# Altium project Social_Security_Master V2.4.PrjPcb
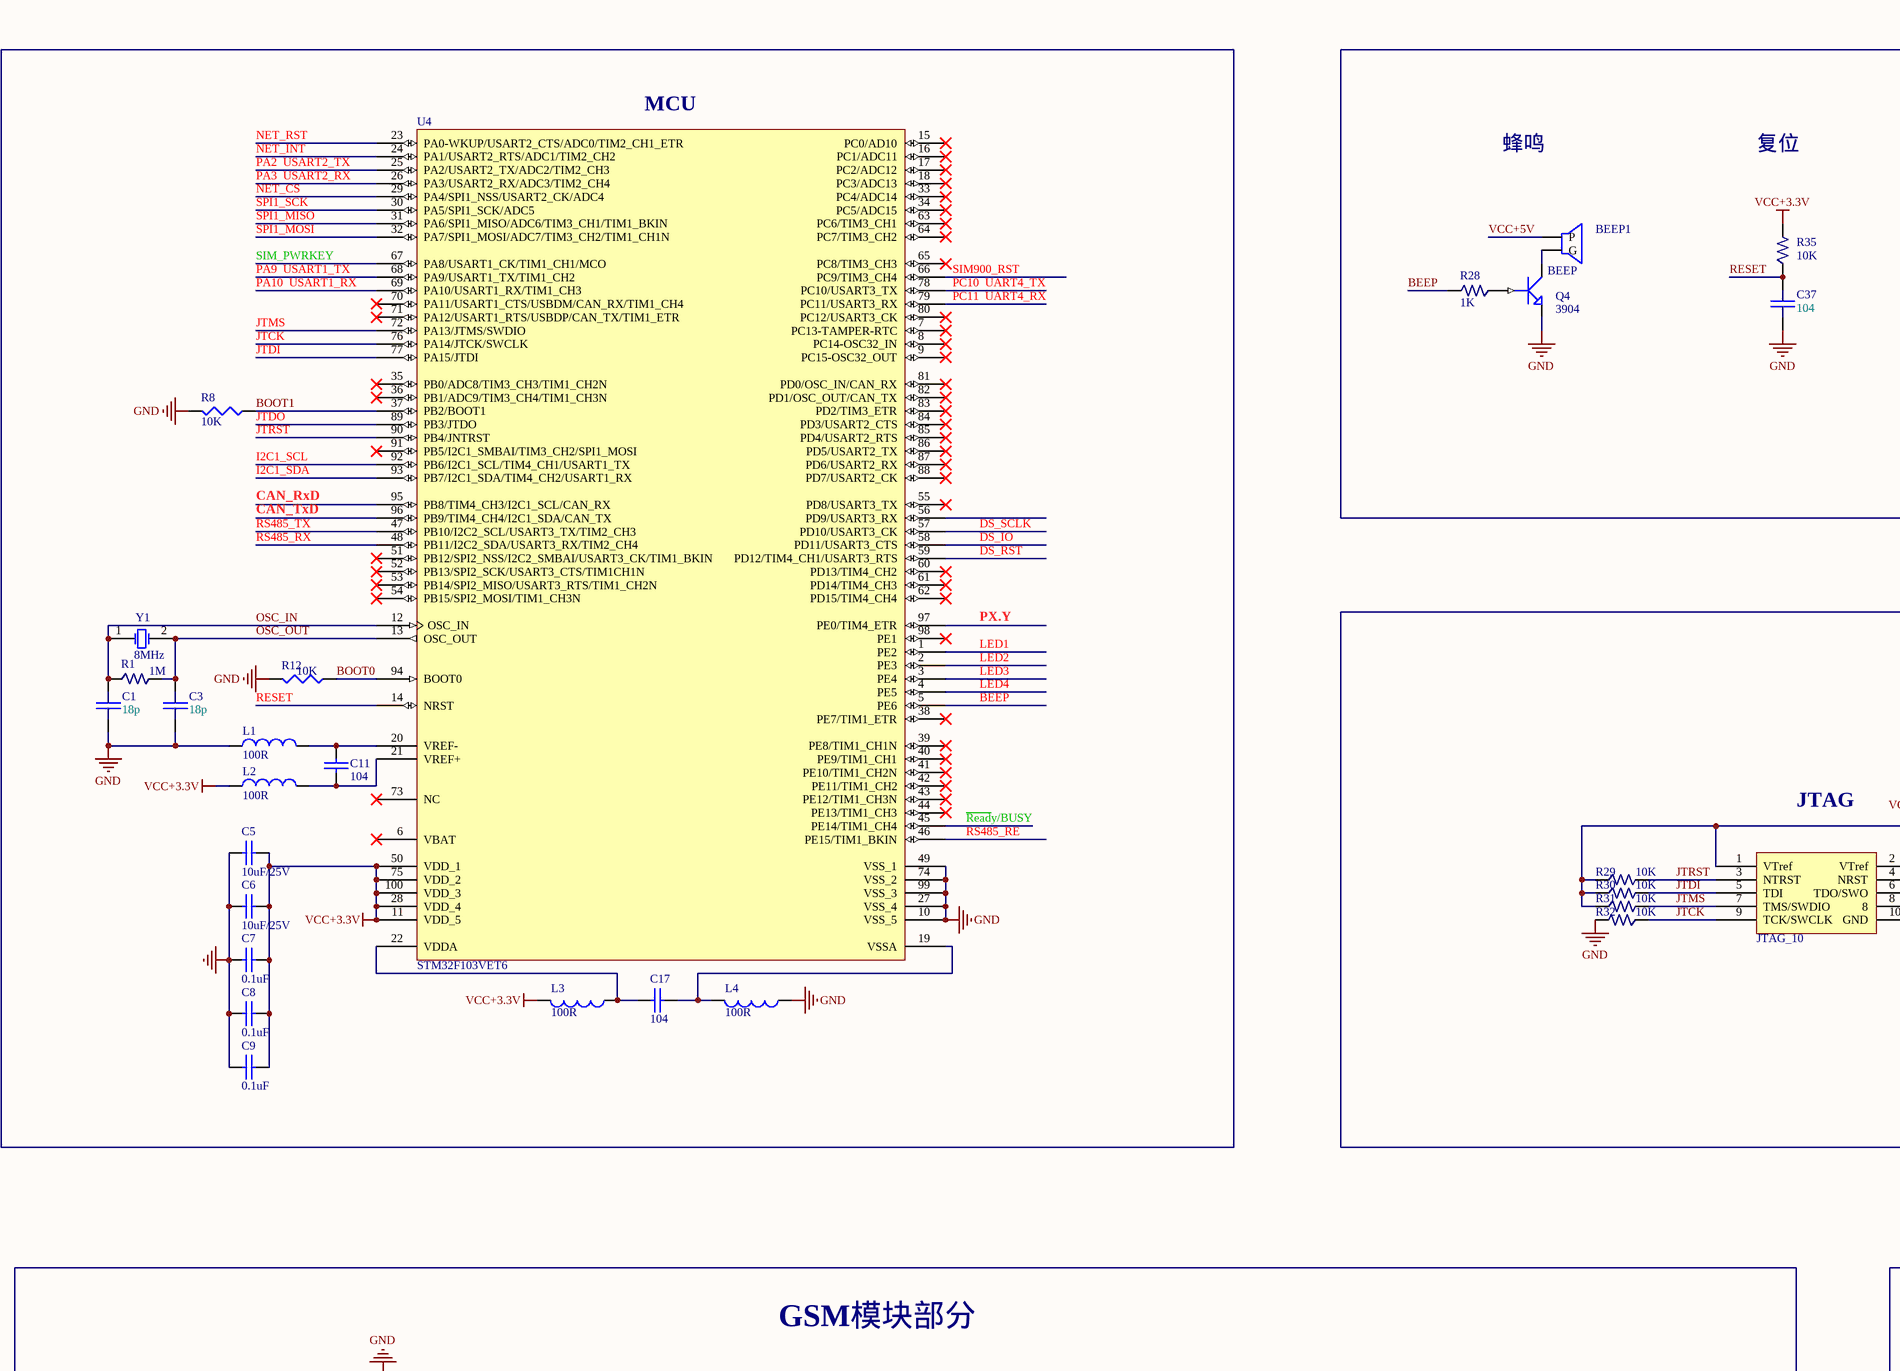
[diagram p0: Sheet1.SchDoc, top left]
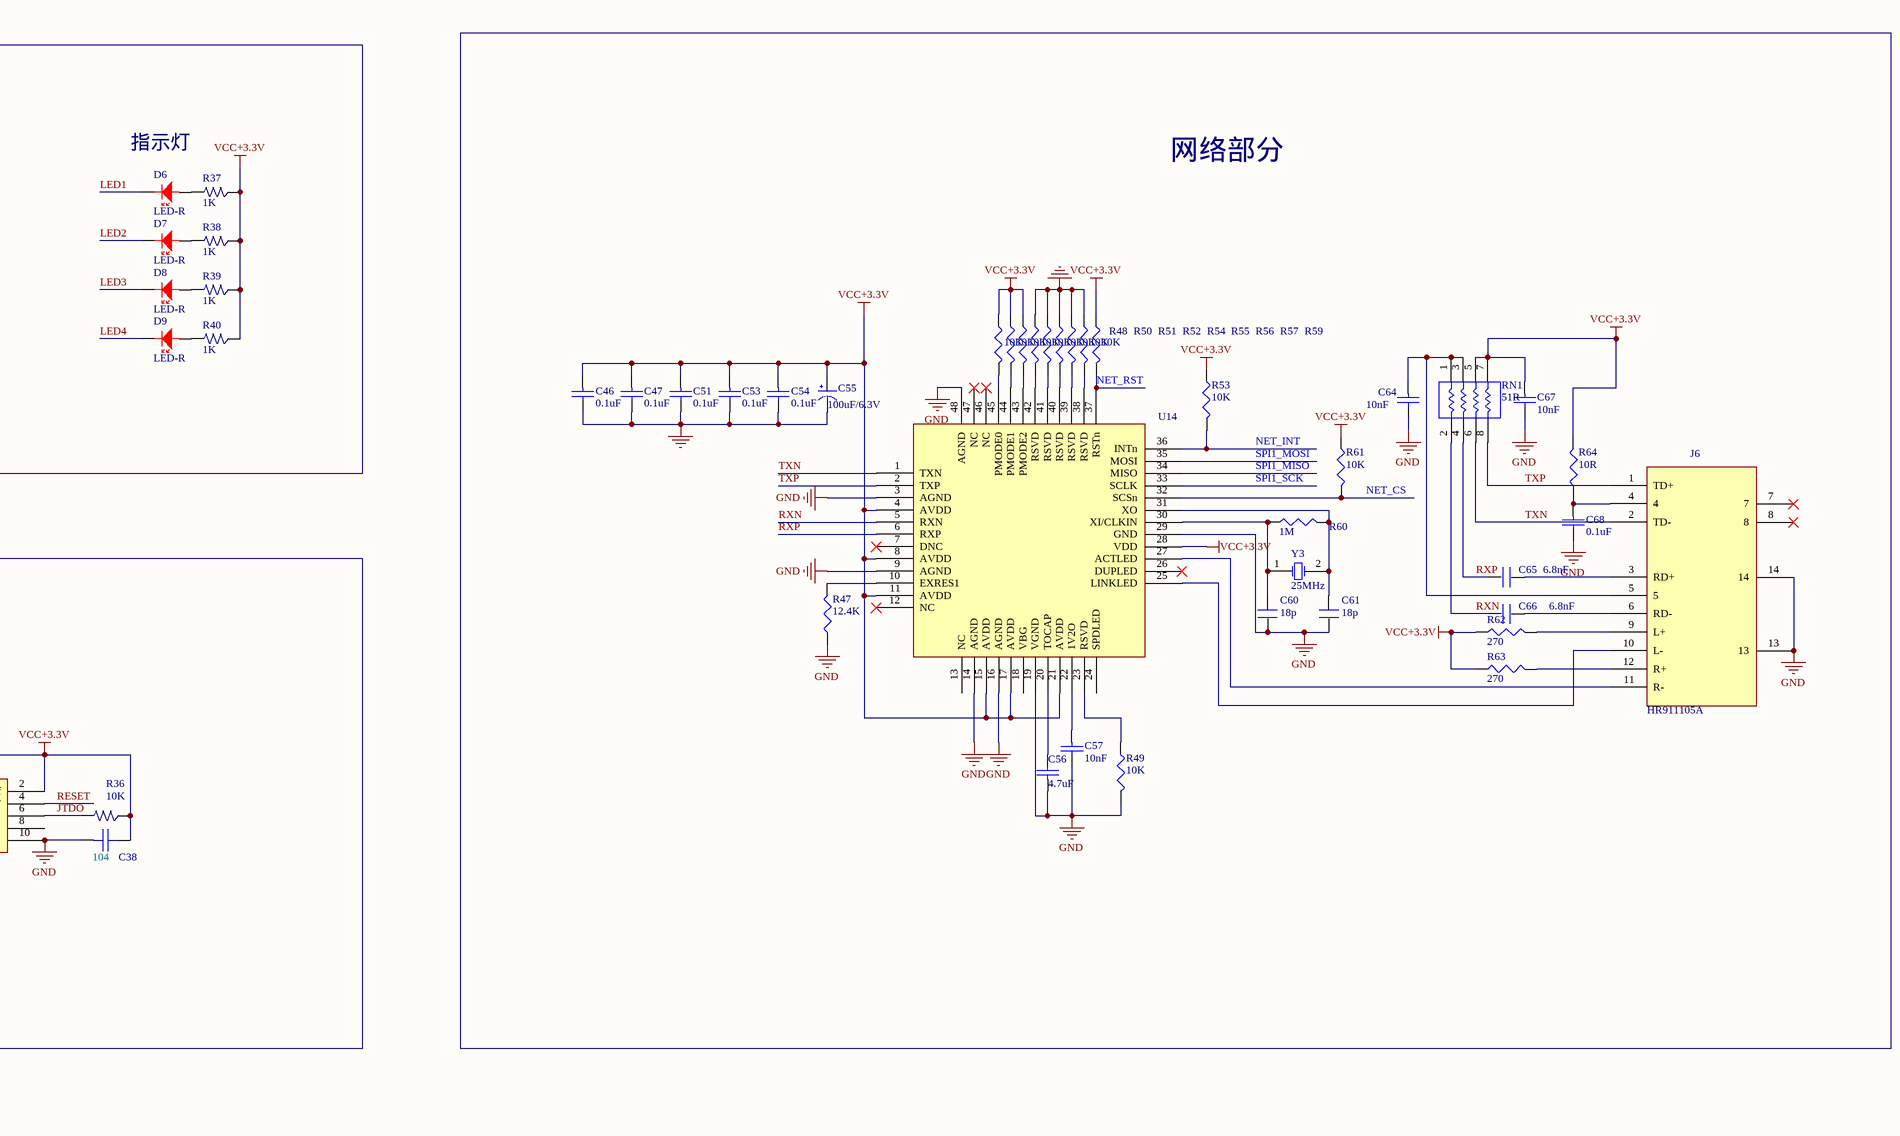
[diagram p1: Sheet1.SchDoc, top right]
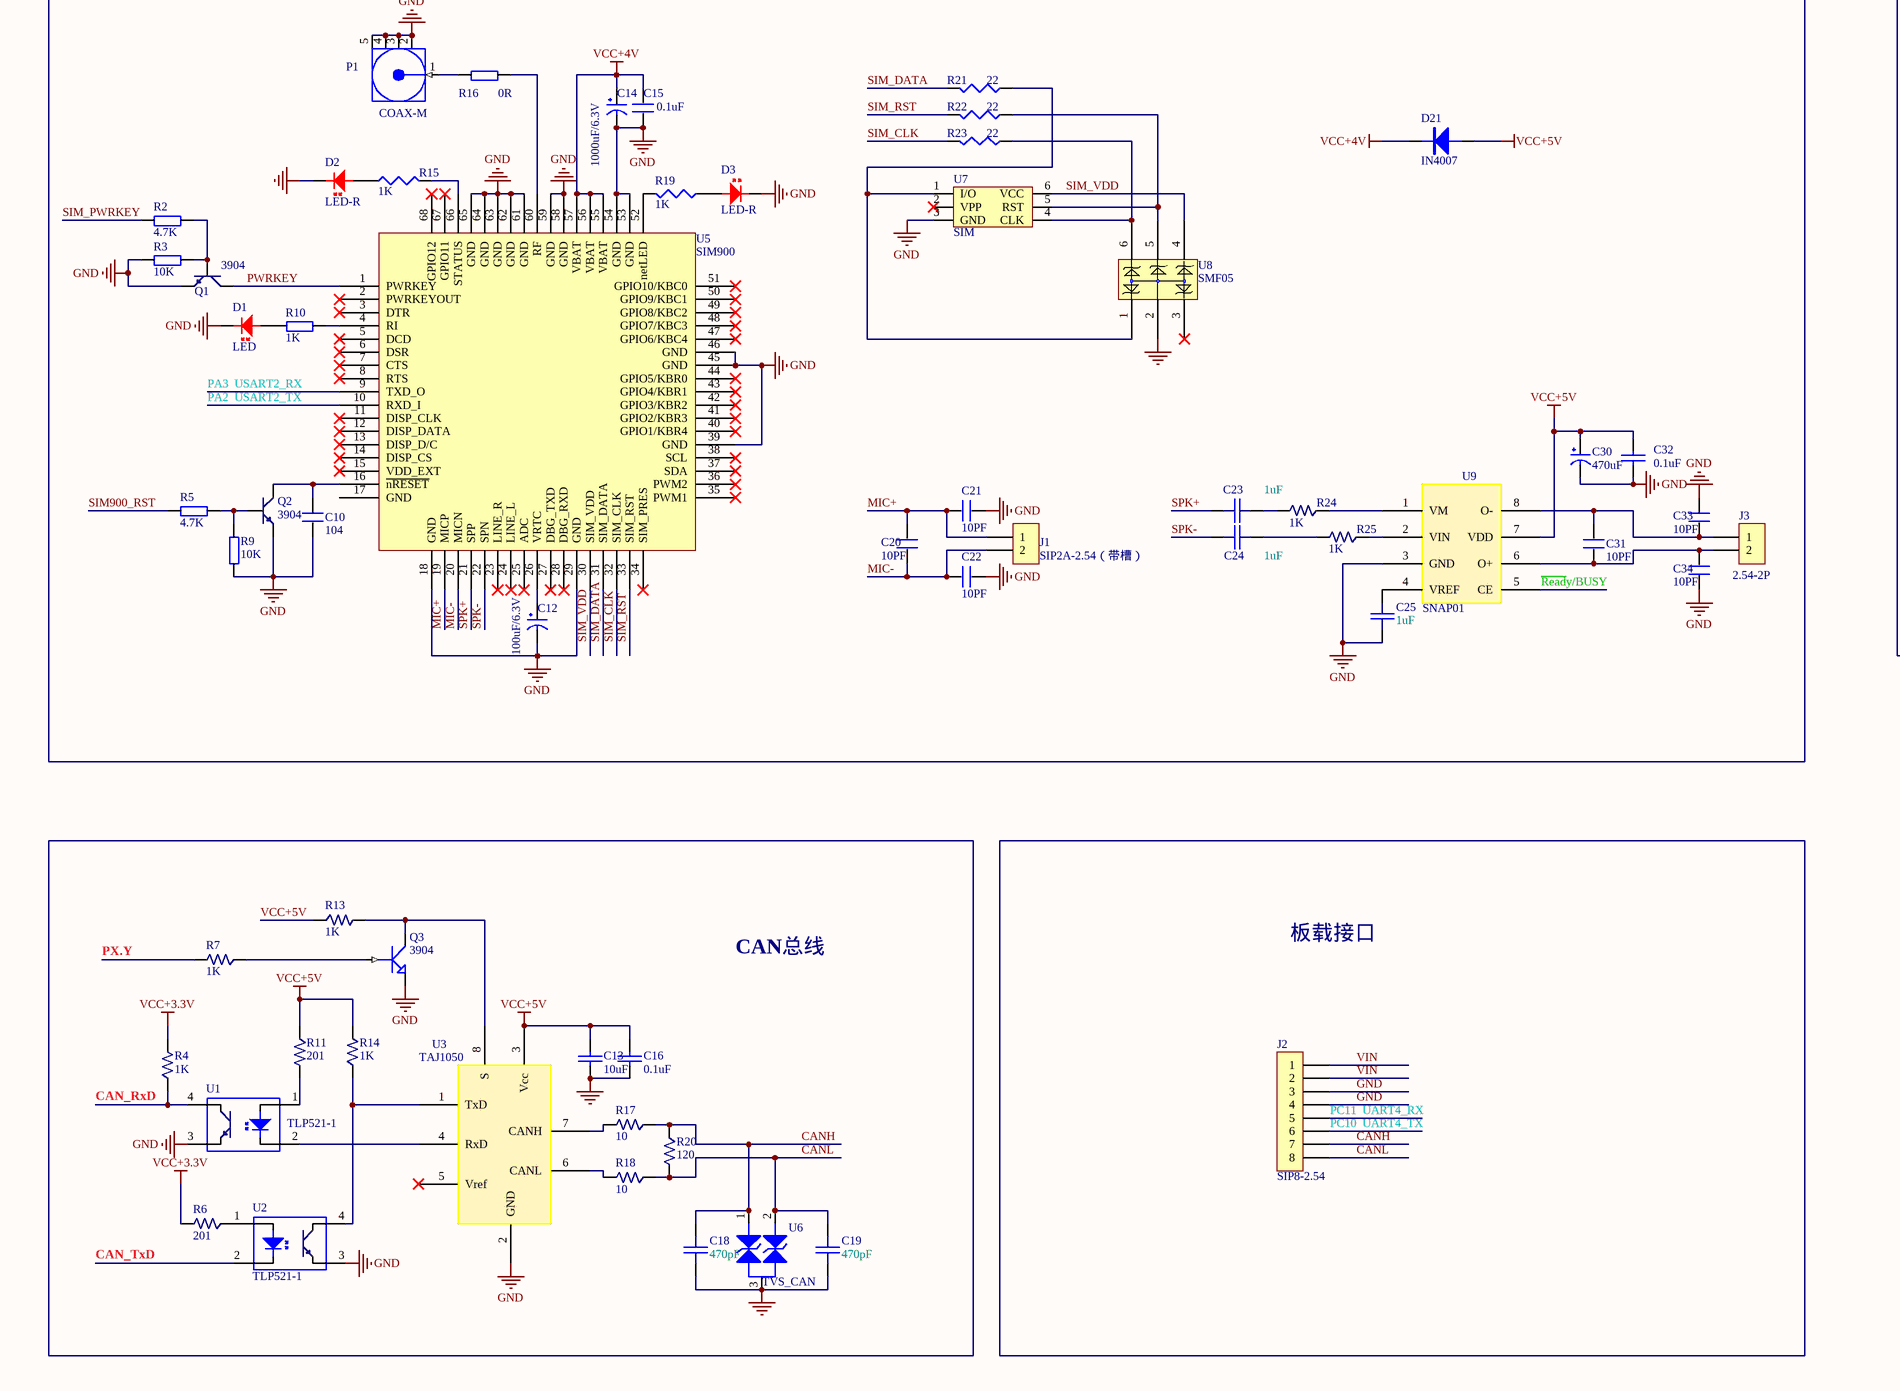
[diagram p2: Sheet1.SchDoc, bottom left]
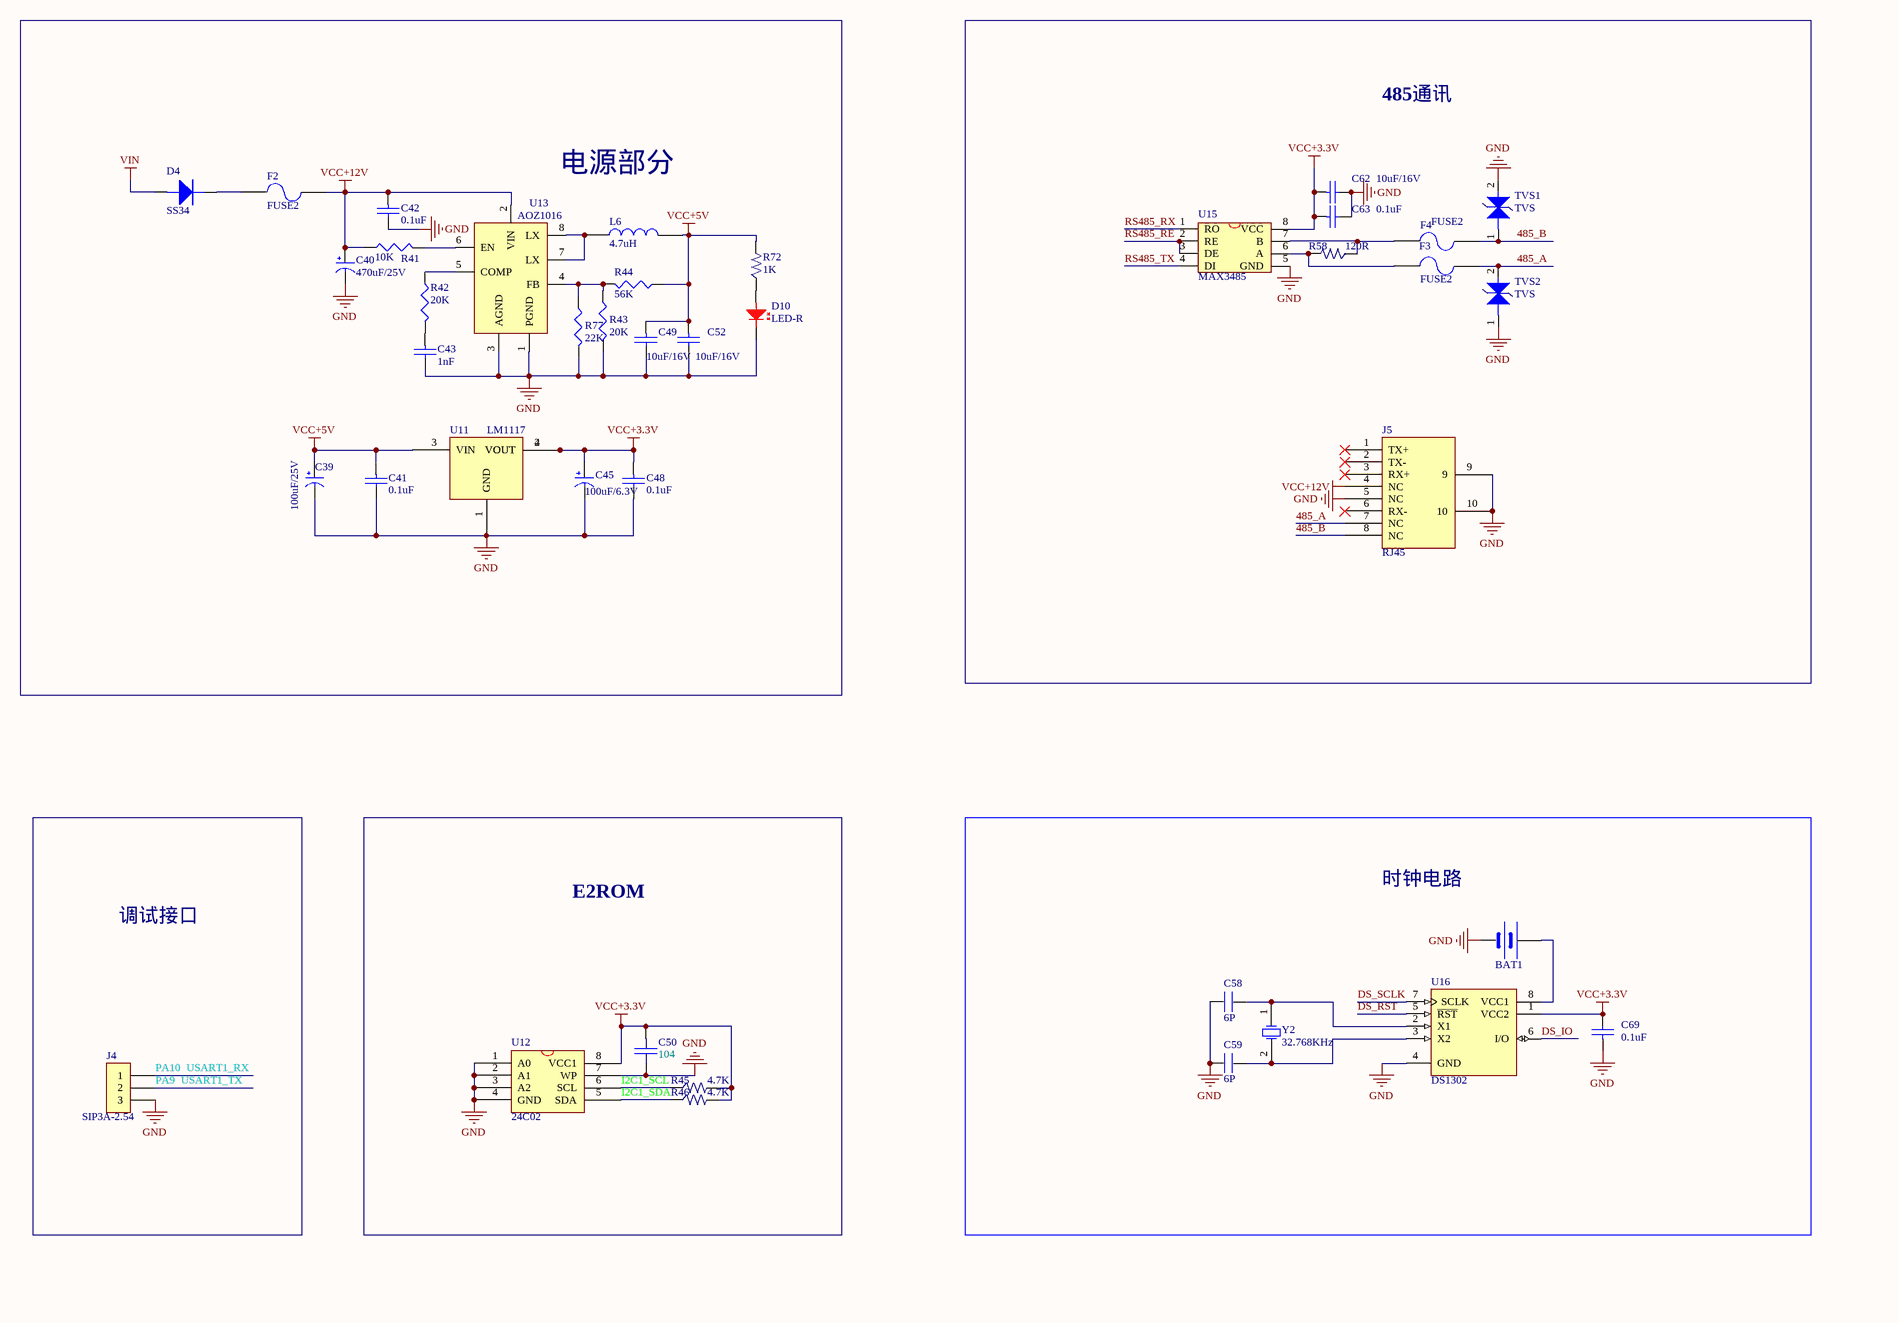
[diagram p3: Sheet1.SchDoc, bottom right]
1 sheet, 175 parts. Net scope: global (net labels, ports and power ports of the same name join across sheets).
Board file: PCB1.PcbDoc

## Sheet Sheet1.SchDoc
size A1

### Parts
BAT1  BATT  [CR1220]  (value not drawn)
BEEP1  BEEP  [BEEP-12]
C1  18p  [0603]
C3  18p  [0603]
C5  10uF/25V  [0805]
C6  10uF/25V  [0805]
C7  0.1uF  [0603]
C8  0.1uF  [0603]
C9  0.1uF  [0603]
C10  104  [0603]
C11  104  [0603]
C12  100uF/6.3V  [A-3528]
C13  10uF  [0805]
C14  1000uF/6.3V  [7343]
C15  0.1uF  [0805]
C16  0.1uF  [0603]
C17  104  [0603]
C18  470pF  [0603]
C19  470pF  [0603]
C20  10PF  [0603]
C21  10PF  [0603]
C22  10PF  [0603]
C23  1uF  [0603]
C24  1uF  [0603]
C25  1uF  [0603]
C30  470uF  [RB3.5]
C31  10PF  [0603]
C32  0.1uF  [0603]
C33  10PF  [0603]
C34  10PF  [0603]
C37  104  [0603]
C38  104  [0603]
C39  100uF/25V  [RB2.54]
C40  470uF/25V  [RB3.5]
C41  0.1uF  [0603]
C42  0.1uF  [0603]
C43  1nF  [0603]
C45  100uF/6.3V  [A-3528]
C46  0.1uF  [0603]
C47  0.1uF  [0603]
C48  0.1uF  [0603]
C49  10uF/16V  [0805]
C50  104  [0603]
C51  0.1uF  [0603]
C52  10uF/16V  [0805]
C53  0.1uF  [0603]
C54  0.1uF  [0603]
C55  100uF/6.3V  [A-3528]
C56  4.7uF  [0603]
C57  10nF  [0603]
C58  6P  [0603]
C59  6P  [0603]
C60  18p  [0603]
C61  18p  [0603]
C62  10uF/16V  [0805]
C63  0.1uF  [0603]
C64  10nF  [0603]
C65  6.8nF  [0603]
C66  6.8nF  [0603]
C67  10nF  [0603]
C68  0.1uF  [0603]
C69  0.1uF  [0603]
D1  LED  [LED-0603]
D2  LED-R  [LED-0603]
D3  LED-R  [LED-0603]
D4  SS34  [SMB]
D6  LED-R  [LED-0603]
D7  LED-R  [LED-0603]
D8  LED-R  [LED-0603]
D9  LED-R  [LED-0603]
D10  LED-R  [LED-0603]
D21  IN4007  [SMB]
F2  FUSE2  [FUSE RL60-110]
F3  FUSE2  [0805]
F4  FUSE2  [0805]
J1  SIP2A-2.54（带槽）  [2.54]
J2  SIP8-2.54  [2.54-8]
J3  2.54-2P  [2.54]
J4  SIP3A-2.54  [2.54-3]
J5  RJ45  [RJ45-10P8L]
J6  HR911105A  [HR911105A]
JTAG  JTAG_10  [JTAG_10]
L1  100R  [0805]
L2  100R  [0805]
L3  100R  [0805]
L4  100R  [0805]
L6  4.7uH  [INDUCTOR 7*7]
P1  COAX-M  [ST-TH1]
Q1  3904  [SOT-23R]
Q2  3904  [SOT-23R]
Q3  3904  [SOT-23]
Q4  3904  [SOT-23]
R1  1M  [0603]
R2  4.7K  [0603]
R3  10K  [0603]
R4  1K  [0603]
R5  4.7K  [0603]
R6  201  [0603]
R7  1K  [0603]
R8  10K  [0603]
R9  10K  [0603]
R10  1K  [0603]
R11  201  [0603]
R12  10K  [0603]
R13  1K  [0603]
R14  1K  [0603]
R15  1K  [0603]
R16  0R  [0603]
R17  10  [0603]
R18  10  [0603]
R19  1K  [0603]
R20  120  [0603]
R21  22  [0603]
R22  22  [0603]
R23  22  [0603]
R24  1K  [0603]
R25  1K  [0603]
R28  1K  [0603]
R29  10K  [0603]
R30  10K  [0603]
R31  10K  [0603]
R32  10K  [0603]
R35  10K  [0603]
R36  10K  [0603]
R37  1K  [0603]
R38  1K  [0603]
R39  1K  [0603]
R40  1K  [0603]
R41  10K  [0603]
R42  20K  [0603]
R43  20K  [0603]
R44  56K  [0603]
R45  4.7K  [0603]
R46  4.7K  [0603]
R47  12.4K  [0603]
R48  10K  [0603]
R49  10K  [0603]
R50  10K  [0603]
R51  10K  [0603]
R52  10K  [0603]
R53  10K  [0603]
R54  10K  [0603]
R55  10K  [0603]
R56  10K  [0603]
R57  10K  [0603]
R58  120R  [0805]
R59  10K  [0603]
R60  1M  [0603]
R61  10K  [0603]
R62  270  [0603]
R63  270  [0603]
R64  10R  [0603]
R72  1K  [0603]
R77  22K  [0603]
RN1  51R  [0603-4]
TVS1  TVS  [SMB]
TVS2  TVS  [SMB]
U1  TLP521-1  [DIP4]
U2  TLP521-1  [DIP4]
U3  TAJ1050  [SO-8]
U4  STM32F103VET6  [LQFP100_N]
U5  SIM900  [SIM-900]
U6  TVS_CAN  [SOT-23]
U7  SIM  [SIM-6P-T]
U8  SMF05  [SL70-6L]
U9  SNAP01  [sop-8]
U11  LM1117  [SOT-223]
U12  24C02  [SO-8]
U13  AOZ1016  [SO-8]
U14  W5500  [LQFP48_N]  (value not drawn)
U15  MAX3485  [SOP-8]
U16  DS1302  [SOP-8]
Y1  8MHz  [XTAL_US]
Y2  32.768KHz  [cs206]
Y3  25MHz  [XTAL_US]

### Blocks framed on the sheet
网络部分: C46 C47 C51 C53-C57 C60 C61 C64-C68 J6 R47-R57 R59-R64 RN1 U14 Y3
MCU: C1 C3 C5-C9 C11 C17 L1-L4 R1 R8 R12 U4 Y1
JTAG: C38 JTAG R29-R32 R36
GSM模块部分: C10 C12 C14 C15 C20-C25 C30-C34 D1-D3 D21 J1 J3 P1 Q1 Q2 R2 R3 R5 R9 R10 R15 R16 R19 R21-R25 U5 U7-U9
电源部分: C39-C43 C45 C48 C49 C52 D4 D10 F2 L6 R41-R44 R72 R77 U11 U13
485通讯: C62 C63 F3 F4 J5 R58 TVS1 TVS2 U15
调试接口: J4
E2ROM: C50 R45 R46 U12
时钟电路: BAT1 C58 C59 C69 U16 Y2
CAN总线: C13 C16 C18 C19 Q3 R4 R6 R7 R11 R13 R14 R17 R18 R20 U1-U3 U6
板载接口: J2

### Nets
GND: BAT1.2(GND) C1.2 C3.2 C5.1 C6.1 C7.1 C8.1 C9.1 C10.1 C12.2(GND) C13.1 C14.2(GND) C15.2 C16.1 C18.2 C19.2 C21.2 C22.2 C25.2 C30.2(GND) C32.1 C33.1 C34.2 C37.1 C38.1 C39.2(GND) C40.2(GND) C41.2 C42.2 C43.2 C45.2(GND) C46.2 C47.2 C48.2 C49.2 C50.2 C51.2 C52.2 C53.2 C54.2 C55.2(GND) C56.1 C57.2 C58.1 C59.1 C60.1 C61.1 C62.2 C63.2 C64.2 C67.2 C68.2 C69.1 D1.2 D2.2 D3.2 D10.2 J2.3 J2.4 J4.3 J5.5(NC) J5.9 J5.10 J6.13 J6.14 JTAG.10(GND) L1.1 L4.1 P1.2(GND) P1.3(GND) P1.4(GND) P1.5(GND) Q1.1(E) Q2.1(E) Q3.2(E) Q4.2(E) R3.1 R8.2 R9.1 R12.2 R32.2 R43.2 R47.1 R49.2 R52.1 R54.1 R55.1 R56.1 R57.1 R77.2 TVS1.2(K) TVS2.1(A) U1.3 U2.3 U3.2(GND) U4.10(VSS_5) U4.27(VSS_4) U4.49(VSS_1) U4.74(VSS_2) U4.99(VSS_3) U5.18(GND) U5.29(GND) U5.39(GND) U5.45(GND) U5.46(GND) U5.53(GND) U5.54(GND) U5.58(GND) U5.59(GND) U5.61(GND) U5.62(GND) U5.63(GND) U5.64(GND) U5.65(GND) U6.3 U7.3(GND) U8.2 U9.3(GND) U11.1(GND) U12.1(A0) U12.2(A1) U12.3(A2) U12.4(GND) U12.7(WP) U13.1(PGND) U13.3(AGND) U14.3(AGND) U14.9(AGND) U14.14(AGND) U14.16(AGND) U14.19(VGND) U14.29(GND) U14.48(AGND) U15.5(GND) U16.4(GND)
VCC+3.3V: C5.2 C6.2 C7.2 C8.2 C9.2 C38.2 C45.1(VCC) C46.1 C47.1 C48.1 C50.1 C51.1 C53.1 C54.1 C55.1(VCC) C62.1 C63.1 C67.1 C69.2 JTAG.1(VTref) JTAG.2(VTref) L2.1 L3.2 R4.2 R6.2 R29.1 R30.1 R31.1 R35.2 R36.1 R37.1 R38.1 R39.1 R40.1 R45.2 R46.2 R48.1 R50.1 R51.1 R53.1 R59.1 R61.1 R62.1 R63.1 R64.2 RN1.5 RN1.7 U4.11(VDD_5) U4.28(VDD_4) U4.50(VDD_1) U4.75(VDD_2) U4.100(VDD_3) U11.2(VOUT) U11.4(VOUT) U12.8(VCC1) U14.4(AVDD) U14.8(AVDD) U14.11(AVDD) U14.15(AVDD) U14.17(AVDD) U14.21(AVDD) U14.28(VDD) U15.8(VCC) U16.1(VCC2)
VCC+4V: C14.1(VCC) C15.1 D21.2(K) U5.55(VBAT) U5.56(VBAT) U5.57(VBAT)
VCC+5V: BEEP1.1(P) C13.2 C16.2 C30.1(VCC) C32.2 C39.1(VCC) C41.1 C49.1 C52.1 D21.1(A) L6.2 R11.1 R13.1 R14.2 R44.1 R72.2 U3.3(Vcc) U9.7(VDD) U11.3(VIN)
VCC+12V: C40.1(VCC) C42.1 F2.2 J5.4(NC) R41.1 U13.2(VIN)
VIN: D4.1(A) J2.1 J2.2
485_A: F3.2 J5.7(NC) TVS2.2(K)
485_B: F4.2 J5.8(NC) TVS1.1(A)
BEEP: R28.2 U4.5(PE6)
BOOT0: R12.1 U4.94(BOOT0)
BOOT1: R8.1 U4.37(PB2/BOOT1)
CAN_RxD: R4.1 U1.4 U4.95(PB8/TIM4_CH3/I2C1_SCL/CAN_RX)
CAN_TxD: U2.2 U4.96(PB9/TIM4_CH4/I2C1_SDA/CAN_TX)
CANH: C18.1 J2.7 R17.1 R20.1 U6.1
CANL: C19.1 J2.8 R18.1 R20.2 U6.2(K)
DS_IO: U4.58(PD11/USART3_CTS) U16.6(I/O)
DS_RST: U4.59(PD12/TIM4_CH1/USART3_RTS) U16.5(~{RST})
DS_SCLK: U4.57(PD10/USART3_CK) U16.7(SCLK)
I2C1_SCL: R45.1 U4.92(PB6/I2C1_SCL/TIM4_CH1/USART1_TX) U12.6(SCL)
I2C1_SDA: R46.1 U4.93(PB7/I2C1_SDA/TIM4_CH2/USART1_RX) U12.5(SDA)
JTCK: JTAG.9(TCK/SWCLK) R32.1 U4.76(PA14/JTCK/SWCLK)
JTDI: JTAG.5(TDI) R30.2 U4.77(PA15/JTDI)
JTDO: JTAG.6(TDO/SWO) R36.2 U4.89(PB3/JTDO)
JTMS: JTAG.7(TMS/SWDIO) R31.2 U4.72(PA13/JTMS/SWDIO)
JTRST: JTAG.3(NTRST) R29.2 U4.90(PB4/JNTRST)
LED1: D6.2 U4.1(PE2)
LED2: D7.2 U4.2(PE3)
LED3: D8.2 U4.3(PE4)
LED4: D9.2 U4.4(PE5)
MIC+: C20.1 C21.1 J1.1 U5.19(MICP)
MIC-: C20.2 C22.1 J1.2 U5.20(MICN)
NET_CS: R61.2 U4.29(PA4/SPI1_NSS/USART2_CK/ADC4) U14.32(SCSn)
NET_INT: R53.2 U4.24(PA1/USART2_RTS/ADC1/TIM2_CH2) U14.36(INTn)
NET_RST: R59.2 U4.23(PA0-WKUP/USART2_CTS/ADC0/TIM2_CH1_ETR) U14.37(RSTn)
OSC_IN: C1.1 R1.1 U4.12(OSC_IN) Y1.1(OSC1)
OSC_OUT: C3.1 R1.2 U4.13(OSC_OUT) Y1.2(OSC2)
PA2  USART2_TX: U4.25(PA2/USART2_TX/ADC2/TIM2_CH3) U5.10(RXD_I)
PA3  USART2_RX: U4.26(PA3/USART2_RX/ADC3/TIM2_CH4) U5.9(TXD_O)
PA9  USART1_TX: J4.2 U4.68(PA9/USART1_TX/TIM1_CH2)
PA10  USART1_RX: J4.1 U4.69(PA10/USART1_RX/TIM1_CH3)
PC10  UART4_TX: J2.6 U4.78(PC10/USART3_TX)
PC11  UART4_RX: J2.5 U4.79(PC11/USART3_RX)
PWRKEY: Q1.3(C) U5.1(PWRKEY)
PX.Y: R7.2 U4.97(PE0/TIM4_ETR)
~{Read}y/BUSY: U4.45(PE14/TIM1_CH4) U9.5(CE)
RESET: C37.2 JTAG.4(NRST) R35.1 U4.14(NRST)
RS485_RE: U4.46(PE15/TIM1_BKIN) U15.2(RE) U15.3(DE)
RS485_RX: U4.48(PB11/I2C2_SDA/USART3_RX/TIM2_CH4) U15.1(RO)
RS485_TX: U4.47(PB10/I2C2_SCL/USART3_TX/TIM2_CH3) U15.4(DI)
RXN: C66.2 RN1.2 U14.5(RXN)
RXP: C65.2 RN1.4 U14.6(RXP)
SIM900_RST: R5.1 U4.66(PC9/TIM3_CH4)
SIM_CLK: R23.2 U5.32(SIM_CLK)
SIM_DATA: R21.2 U5.31(SIM_DATA)
SIM_PWRKEY: R2.1 U4.67(PA8/USART1_CK/TIM1_CH1/MCO)
SIM_RST: R22.2 U5.33(SIM_RST)
SIM_VDD: U5.30(SIM_VDD) U7.6(VCC) U8.4
SPI1_MISO: U4.31(PA6/SPI1_MISO/ADC6/TIM3_CH1/TIM1_BKIN) U14.34(MISO)
SPI1_MOSI: U4.32(PA7/SPI1_MOSI/ADC7/TIM3_CH2/TIM1_CH1N) U14.35(MOSI)
SPI1_SCK: U4.30(PA5/SPI1_SCK/ADC5) U14.33(SCLK)
SPK+: C23.2 U5.21(SPP)
SPK-: C24.2 U5.22(SPN)
TXN: J6.2(TD-) RN1.6 U14.1(TXN)
TXP: J6.1(TD+) RN1.8 U14.2(TXP)
NetBAT1_1: BAT1.1(VCC) U16.8(VCC1)
NetBEEP1_2: BEEP1.2(G) Q4.3(C)
NetC10_2: C10.2 Q2.3(C) U5.16(~{nRESET})
NetC11_1: C11.1 L1.2 U4.20(VREF-)
NetC11_2: C11.2 L2.2 U4.21(VREF+)
NetC12_1: C12.1(VCC) U5.26(VRTC)
NetC17_1: C17.1 L3.1 U4.22(VDDA)
NetC17_2: C17.2 L4.2 U4.19(VSSA)
NetC23_1: C23.1 R24.2
NetC24_1: C24.1 R25.2
NetC25_1: C25.1 U9.4(VREF)
NetC31_1: C31.1 C33.2 J3.1 U9.8(O-)
NetC31_2: C31.2 C34.1 J3.2 U9.6(O+)
NetC43_1: C43.1 R42.2
NetC56_2: C56.2 U14.20(TOCAP)
NetC57_1: C57.1 U14.22(1V2O)
NetC58_2: C58.2 U16.2(X1) Y2.1(OSC1)
NetC59_2: C59.2 U16.3(X2) Y2.2(OSC2)
NetC60_2: C60.2 R60.1 U14.30(XI/CLKIN) Y3.1(OSC1)
NetC61_2: C61.2 R60.2 U14.31(XO) Y3.2(OSC2)
NetC64_1: C64.1 J6.5 RN1.1 RN1.3
NetC65_1: C65.1 J6.3(RD+)
NetC66_1: C66.1 J6.6(RD-)
NetC68_1: C68.1 J6.4 R64.1
NetD1_1: D1.1 R10.1
NetD2_1: D2.1 R15.1
NetD3_1: D3.1 R19.1
NetD4_2: D4.2(K) F2.1
NetD6_1: D6.1 R37.2
NetD7_1: D7.1 R38.2
NetD8_1: D8.1 R39.2
NetD9_1: D9.1 R40.2
NetD10_1: D10.1 R72.1
NetF3_1: F3.1 R58.2 U15.6(A)
NetF4_1: F4.1 R58.1 U15.7(B)
NetJ6_9: J6.9(L+) R62.2
NetJ6_10: J6.10(L-) U14.25(LINKLED)
NetJ6_11: J6.11(R-) U14.27(ACTLED)
NetJ6_12: J6.12(R+) R63.2
NetL6_1: L6.1 U13.7(LX) U13.8(LX)
NetP1_1: P1.1(Signal) R16.1
NetQ1_2: Q1.2(B) R2.2 R3.2
NetQ2_2: Q2.2(B) R5.2 R9.2
NetQ3_1: Q3.1(B) R7.1
NetQ3_3: Q3.3(C) R13.2 U3.8(S)
NetQ4_1: Q4.1(B) R28.1
NetR6_1: R6.1 U2.1
NetR10_2: R10.2 U5.4(RI)
NetR11_2: R11.2 U1.1
NetR14_1: R14.1 U2.4 U3.1(TxD)
NetR15_2: R15.2 U5.66(STATUS)
NetR16_2: R16.2 U5.60(RF)
NetR17_2: R17.2 U3.7(CANH)
NetR18_2: R18.2 U3.6(CANL)
NetR19_2: R19.2 U5.52(netLED)
NetR21_1: R21.1 U7.1(I/O) U8.1
NetR22_1: R22.1 U7.5(RST) U8.5
NetR23_1: R23.1 U7.4(CLK) U8.6
NetR24_1: R24.1 U9.1(VM)
NetR25_1: R25.1 U9.2(VIN)
NetR41_2: R41.2 U13.6(EN)
NetR42_1: R42.1 U13.5(COMP)
NetR43_1: R43.1 R44.2 R77.1 U13.4(FB)
NetR47_2: R47.2 U14.10(EXRES1)
NetR48_2: R48.2 U14.45(PMODE0)
NetR49_1: R49.1 U14.23(RSVD)
NetR50_2: R50.2 U14.44(PMODE1)
NetR51_2: R51.2 U14.43(PMODE2)
NetR52_2: R52.2 U14.42(RSVD)
NetR54_2: R54.2 U14.41(RSVD)
NetR55_2: R55.2 U14.40(RSVD)
NetR56_2: R56.2 U14.39(RSVD)
NetR57_2: R57.2 U14.38(RSVD)
NetU1_2: U1.2 U3.4(RxD)

Not connected (* = marked no-connect by the designer): J5 1(TX+)* 2(TX-)* 3(RX+)* 6(RX-)*; J6 7* 8*; JTAG 8; U3 5(Vref)*; U4 6(VBAT)* 7(PC13-TAMPER-RTC)* 8(PC14-OSC32_IN)* 9(PC15-OSC32_OUT)* 15(PC0/AD10)* 16(PC1/ADC11)* 17(PC2/ADC12)* 18(PC3/ADC13)* 33(PC4/ADC14)* 34(PC5/ADC15)* 35(PB0/ADC8/TIM3_CH3/TIM1_CH2N)* 36(PB1/ADC9/TIM3_CH4/TIM1_CH3N)* 38(PE7/TIM1_ETR)* 39(PE8/TIM1_CH1N)* 40(PE9/TIM1_CH1)* 41(PE10/TIM1_CH2N)* 42(PE11/TIM1_CH2)* 43(PE12/TIM1_CH3N)* 44(PE13/TIM1_CH3)* 51(PB12/SPI2_NSS/I2C2_SMBAI/USART3_CK/TIM1_BKIN)* 52(PB13/SPI2_SCK/USART3_CTS/TIM1CH1N)* 53(PB14/SPI2_MISO/USART3_RTS/TIM1_CH2N)* 54(PB15/SPI2_MOSI/TIM1_CH3N)* 55(PD8/USART3_TX)* 56(PD9/USART3_RX) 60(PD13/TIM4_CH2)* 61(PD14/TIM4_CH3)* 62(PD15/TIM4_CH4)* 63(PC6/TIM3_CH1)* 64(PC7/TIM3_CH2)* 65(PC8/TIM3_CH3)* 70(PA11/USART1_CTS/USBDM/CAN_RX/TIM1_CH4)* 71(PA12/USART1_RTS/USBDP/CAN_TX/TIM1_ETR)* 73(NC)* 80(PC12/USART3_CK)* 81(PD0/OSC_IN/CAN_RX)* 82(PD1/OSC_OUT/CAN_TX)* 83(PD2/TIM3_ETR)* 84(PD3/USART2_CTS)* 85(PD4/USART2_RTS)* 86(PD5/USART2_TX)* 87(PD6/USART2_RX)* 88(PD7/USART2_CK)* 91(PB5/I2C1_SMBAI/TIM3_CH2/SPI1_MOSI)* 98(PE1)*; U5 2(PWRKEYOUT)* 3(DTR)* 5(DCD)* 6(DSR)* 7(CTS)* 8(RTS)* 11(DISP_CLK)* 12(DISP_DATA)* 13(DISP_D/C)* 14(DISP_CS)* 15(VDD_EXT)* 17(GND) 23(LINE_R)* 24(LINE_L)* 25(ADC)* 27(DBG_TXD)* 28(DBG_RXD)* 34(SIM_PRES)* 35(PWM1)* 36(PWM2)* 37(SDA)* 38(SCL)* 40(GPIO1/KBR4)* 41(GPIO2/KBR3)* 42(GPIO3/KBR2)* 43(GPIO4/KBR1)* 44(GPIO5/KBR0)* 47(GPIO6/KBC4)* 48(GPIO7/KBC3)* 49(GPIO8/KBC2)* 50(GPIO9/KBC1)* 51(GPIO10/KBC0)* 67(GPIO11)* 68(GPIO12)*; U7 2(VPP)*; U8 3*; U14 7(DNC)* 12(NC)* 13(NC) 18(VBG) 24(SPDLED) 26(DUPLED)* 46(NC)* 47(NC)*

### Notes on the sheet
- 蜂鸣
- 复位
- 指示灯

### Library data of the parts
BAT1 = BAT
C1 C3 C18 C19 C23-C25 C37 C38 C50 = CAP: 陶瓷电容
C5-C9 C11-C14 C16 C17 C30 C32 C39-C43 C46-C49 C51-C54 C57 C62-C64 C67-C69 = CAP
C10 C15 C20-C22 C31 C33 C34 C58-C61 C65 C66 = C
C45 C55 = CAP: 钽电容
C56 = CAP: 0.1uF
D1 D6-D10 = LED-RED: 绿色LED
D2 = LED-RED: 红色LED
D3 = LED-RED: 黄色LED
D4 D21 = DIODE
F2 = FUSE2: RL60-110
F3 F4 = FUSE2: SMD0805P010TS
J1 J3 = SIP2A-2.50（带槽）
J4 = SIP3A-2.50（带槽）: 2.54-3P
L1-L4 L6 = INDUCTOR
P1 = COAX-M: SMA-J-P-H-ST-TH1; PackageDocument: Rev. A, 16-Jun-1997; PCB_Layout: Complies with manufacturer's recommendation.; DrillSize: Corresponds to nominal value.; Published: 15-Jul-2004; LatestRevisionDate: 15-Jul-2004; LatestRevisionNote: Component Replaced.; DatasheetDocument: 30-May-2003; PackageReference: 908-21103; Publisher: Altium Limited; ComponentLink1Description: Manufacturer Link; ComponentLink1URL: http://www.amphenolrf.com/
Q1 Q2 = NPN: 8050/BCW846/BCW847
Q3 Q4 = NPN1
R1 R4 R6 R7 R11 R13 R14 R17 R18 R20 R24 R25 R28-R32 R35-R40 R45 R46 R58 R72 = RES-1%: 高精度电阻
R2 R3 R5 R9 R10 R16 = Res
R8 R12 R15 R19 R21-R23 R41-R44 R47-R57 R59-R64 R77 = RES1
RN1 = RESPACK
TVS1 TVS2 = TVS: SMBJ6.0CA
U1 U2 = TLP521: 光耦
U4 = STM32F103VET6: STM32 ARM-based 32-bit MCU with 64 Kbytes Flash, 100-pin LQFP, Industrial Temperature; Published: 30-May-2008; DatasheetVersion: rev6, Mar-2008; PackageVersion: Mar-2008; PackageReference: LQFP100; Publisher: Altium Limited; PackageDescription: 100-Pin Low-Profile Quad Flat Pack, 14 x 14 mm Body, 0.5 mm Pitch (LQFP100); ComponentLink1Description: Manufacturer Link; ComponentLink1URL: www.st.com/stm32; ComponentLink2Description: Datasheet; ComponentLink2URL: http://www.st.com/stonline/products/literature/ds/13587.pdf
U6 = TVS_CAN: NUP2105L
U7 = SIM: 手机SIM卡
U12 = 24C256
U14 = W5500: 以太网
U16 = DS1302: 实时时钟
Y1-Y3 = XTAL: Crystal Oscillator; Published: 8-Jun-2000; LatestRevisionDate: 17-Jul-2002; LatestRevisionNote: Re-released for DXP Platform.; Publisher: Altium Limited